# Altium schematic sheet main.SchDoc
size A
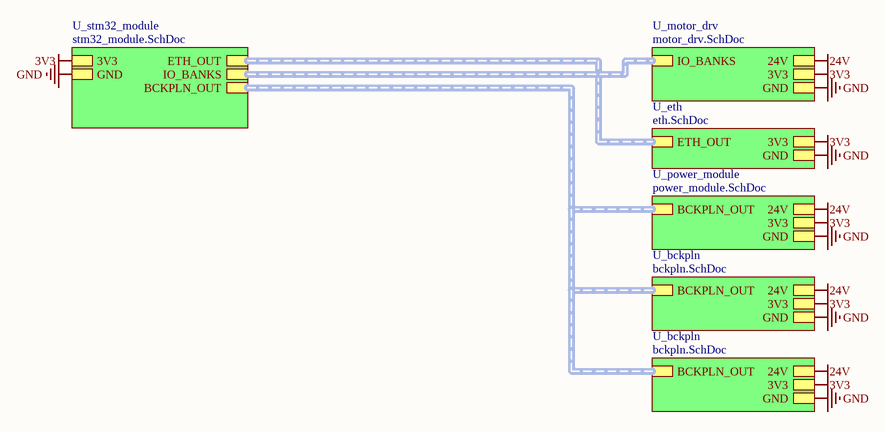
[diagram p0: main.SchDoc]

## Sub-sheets
U_bckpln = bckpln.SchDoc: BCKPLN_OUT (harness BCKPLN_OUT), 3V3, GND, 24V
U_bckpln = bckpln.SchDoc: BCKPLN_OUT (harness BCKPLN_OUT), 3V3, GND, 24V
U_eth = eth.SchDoc: ETH_OUT (harness ETH_OUT), GND, 3V3
U_motor_drv = motor_drv.SchDoc: IO_BANKS (harness IO_BANKS), 3V3, GND, 24V
U_power_module = power_module.SchDoc: 3V3, GND, 24V, BCKPLN_OUT (harness BCKPLN_OUT)
U_stm32_module = stm32_module.SchDoc: ETH_OUT (harness ETH_OUT), IO_BANKS (harness IO_BANKS), BCKPLN_OUT (harness BCKPLN_OUT), 3V3, GND

## Nets
3V3: sheet U_stm32_module/3V3, sheet U_power_module/3V3, sheet U_eth/3V3, sheet U_motor_drv/3V3, sheet U_bckpln/3V3, sheet U_bckpln/3V3
24V: sheet U_power_module/24V, sheet U_motor_drv/24V, sheet U_bckpln/24V, sheet U_bckpln/24V
GND: sheet U_stm32_module/GND, sheet U_power_module/GND, sheet U_eth/GND, sheet U_motor_drv/GND, sheet U_bckpln/GND, sheet U_bckpln/GND

## Buses and harness runs
harness sheet U_bckpln/BCKPLN_OUT = sheet U_power_module/BCKPLN_OUT = sheet U_stm32_module/BCKPLN_OUT
harness sheet U_eth/ETH_OUT = sheet U_stm32_module/ETH_OUT
harness sheet U_motor_drv/IO_BANKS = sheet U_stm32_module/IO_BANKS